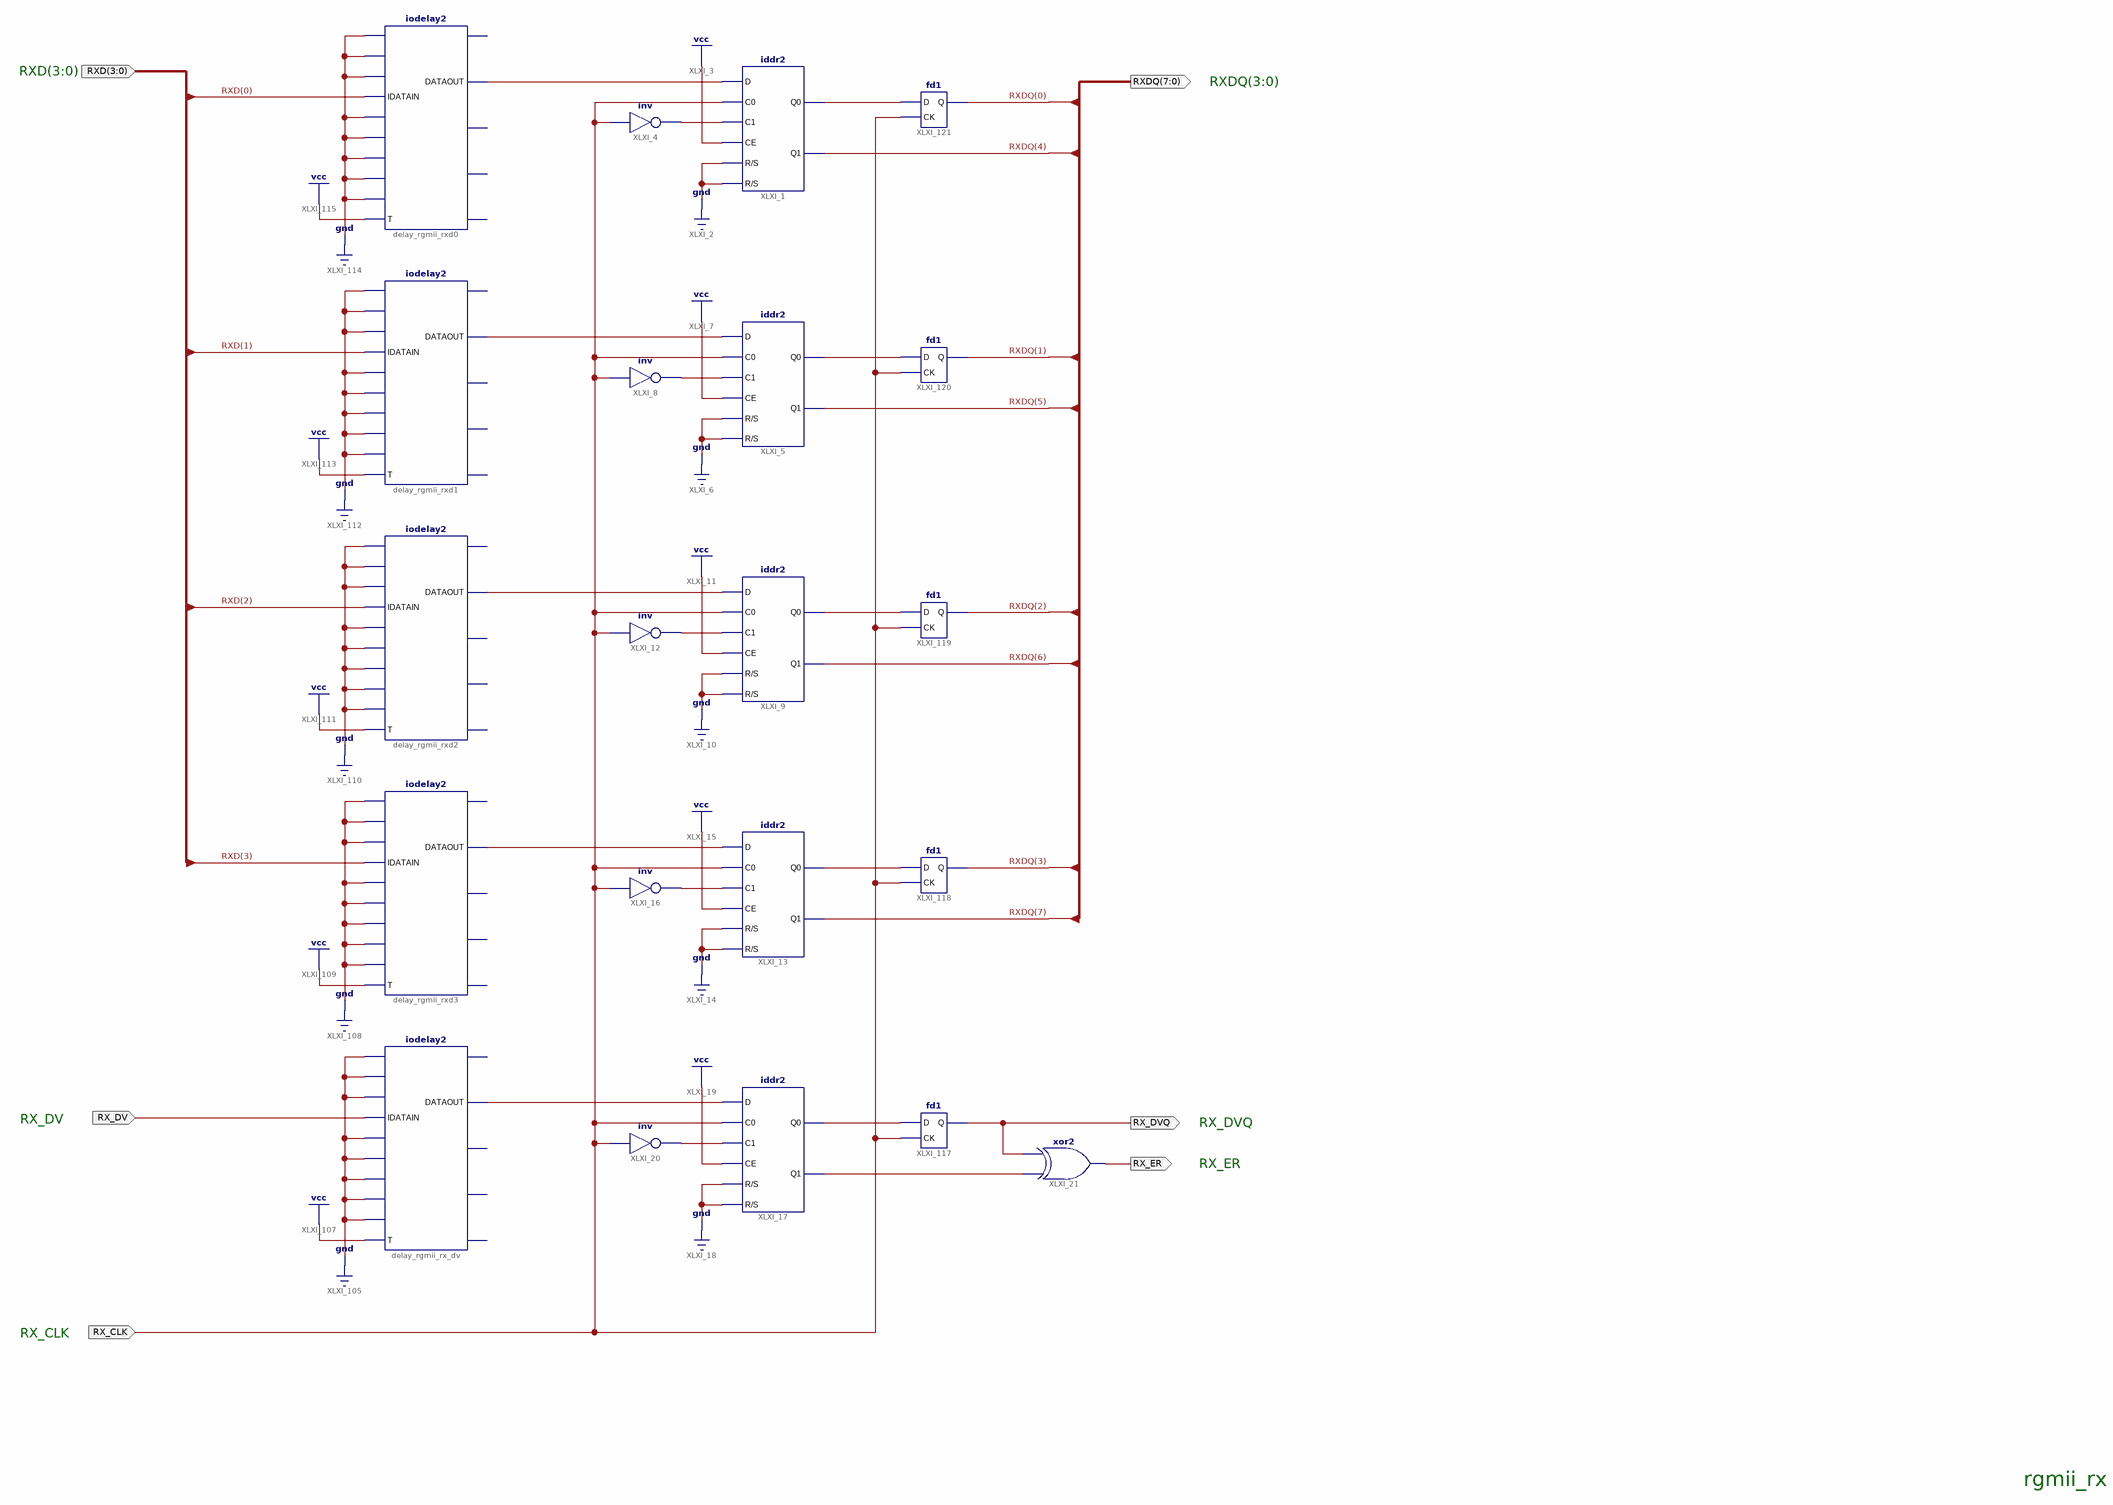
[diagram p0: schematic sheet 1]
// Xilinx ISE schematic rgmii_rx.sch (spartan6) as structural Verilog: 21 symbols, 6 ports
module rgmii_rx (
  input  RX_CLK,
  input  [3:0] RXD,
  input  RX_DV,
  output RX_DVQ,
  output RX_ER,
  output [7:0] RXDQ
);

  wire XLXN_4, XLXN_12, XLXN_19, XLXN_26, XLXN_33, XLXN_42, XLXN_151, XLXN_152, XLXN_153, XLXN_154, XLXN_155,
       XLXN_177, XLXN_178, XLXN_179, XLXN_180, XLXN_181;

  iddr2 #(.DDR_ALIGNMENT("C0")) XLXI_1 (
    .D(XLXN_151), .C0(RX_CLK), .C1(XLXN_4), .CE(1'b1), .R(1'b0), .S(1'b0), .Q0(XLXN_177), .Q1(RXDQ[4]));
  not XLXI_4 (XLXN_4, RX_CLK);
  iddr2 #(.DDR_ALIGNMENT("C0")) XLXI_5 (
    .D(XLXN_152), .C0(RX_CLK), .C1(XLXN_12), .CE(1'b1), .R(1'b0), .S(1'b0), .Q0(XLXN_178), .Q1(RXDQ[5]));
  not XLXI_8 (XLXN_12, RX_CLK);
  iddr2 #(.DDR_ALIGNMENT("C0")) XLXI_9 (
    .D(XLXN_153), .C0(RX_CLK), .C1(XLXN_19), .CE(1'b1), .R(1'b0), .S(1'b0), .Q0(XLXN_179), .Q1(RXDQ[6]));
  not XLXI_12 (XLXN_19, RX_CLK);
  iddr2 #(.DDR_ALIGNMENT("C0")) XLXI_13 (
    .D(XLXN_154), .C0(RX_CLK), .C1(XLXN_26), .CE(1'b1), .R(1'b0), .S(1'b0), .Q0(XLXN_180), .Q1(RXDQ[7]));
  not XLXI_16 (XLXN_26, RX_CLK);
  iddr2 #(.DDR_ALIGNMENT("C0")) XLXI_17 (
    .D(XLXN_155), .C0(RX_CLK), .C1(XLXN_33), .CE(1'b1), .R(1'b0), .S(1'b0), .Q0(XLXN_181), .Q1(XLXN_42));
  not XLXI_20 (XLXN_33, RX_CLK);
  iodelay2 #(.DELAY_SRC("IDATAIN"), .DATA_RATE("DDR"), .COUNTER_WRAPAROUND("STAY_AT_LIMIT"), .IDELAY_TYPE("FIXED")) delay_rgmii_rxd0 (
    .CAL(1'b0), .CE(1'b0), .CLK(1'b0), .IDATAIN(RXD[0]), .INC(1'b0), .IOCLK0(1'b0), .IOCLK1(1'b0),
    .ODATAIN(1'b0), .RST(1'b0), .T(1'b1), .DATAOUT(XLXN_151));  // open: BUSY, DATAOUT2, DOUT, TOUT
  iodelay2 #(.DELAY_SRC("IDATAIN"), .DATA_RATE("DDR"), .COUNTER_WRAPAROUND("STAY_AT_LIMIT"), .IDELAY_TYPE("FIXED")) delay_rgmii_rxd1 (
    .CAL(1'b0), .CE(1'b0), .CLK(1'b0), .IDATAIN(RXD[1]), .INC(1'b0), .IOCLK0(1'b0), .IOCLK1(1'b0),
    .ODATAIN(1'b0), .RST(1'b0), .T(1'b1), .DATAOUT(XLXN_152));  // open: BUSY, DATAOUT2, DOUT, TOUT
  iodelay2 #(.DELAY_SRC("IDATAIN"), .DATA_RATE("DDR"), .COUNTER_WRAPAROUND("STAY_AT_LIMIT"), .IDELAY_TYPE("FIXED")) delay_rgmii_rxd2 (
    .CAL(1'b0), .CE(1'b0), .CLK(1'b0), .IDATAIN(RXD[2]), .INC(1'b0), .IOCLK0(1'b0), .IOCLK1(1'b0),
    .ODATAIN(1'b0), .RST(1'b0), .T(1'b1), .DATAOUT(XLXN_153));  // open: BUSY, DATAOUT2, DOUT, TOUT
  iodelay2 #(.DELAY_SRC("IDATAIN"), .DATA_RATE("DDR"), .COUNTER_WRAPAROUND("STAY_AT_LIMIT"), .IDELAY_TYPE("FIXED")) delay_rgmii_rxd3 (
    .CAL(1'b0), .CE(1'b0), .CLK(1'b0), .IDATAIN(RXD[3]), .INC(1'b0), .IOCLK0(1'b0), .IOCLK1(1'b0),
    .ODATAIN(1'b0), .RST(1'b0), .T(1'b1), .DATAOUT(XLXN_154));  // open: BUSY, DATAOUT2, DOUT, TOUT
  iodelay2 #(.DELAY_SRC("IDATAIN"), .DATA_RATE("DDR"), .COUNTER_WRAPAROUND("STAY_AT_LIMIT"), .IDELAY_TYPE("FIXED")) delay_rgmii_rx_dv (
    .CAL(1'b0), .CE(1'b0), .CLK(1'b0), .IDATAIN(RX_DV), .INC(1'b0), .IOCLK0(1'b0), .IOCLK1(1'b0),
    .ODATAIN(1'b0), .RST(1'b0), .T(1'b1), .DATAOUT(XLXN_155));  // open: BUSY, DATAOUT2, DOUT, TOUT
  xor XLXI_21 (RX_ER, XLXN_42, RX_DVQ);
  fd1 XLXI_117 (.D(XLXN_181), .CK(RX_CLK), .Q(RX_DVQ));
  fd1 XLXI_118 (.D(XLXN_180), .CK(RX_CLK), .Q(RXDQ[3]));
  fd1 XLXI_119 (.D(XLXN_179), .CK(RX_CLK), .Q(RXDQ[2]));
  fd1 XLXI_120 (.D(XLXN_178), .CK(RX_CLK), .Q(RXDQ[1]));
  fd1 XLXI_121 (.D(XLXN_177), .CK(RX_CLK), .Q(RXDQ[0]));

  // Notes on the sheet:
  //   RXD(3:0)
  //   RXDQ(3:0)
  //   RX_DV
  //   RX_DVQ
  //   RX_ER
  //   RX_CLK
  //   rgmii_rx
endmodule
